# Altium project ELEC221.PrjPcb
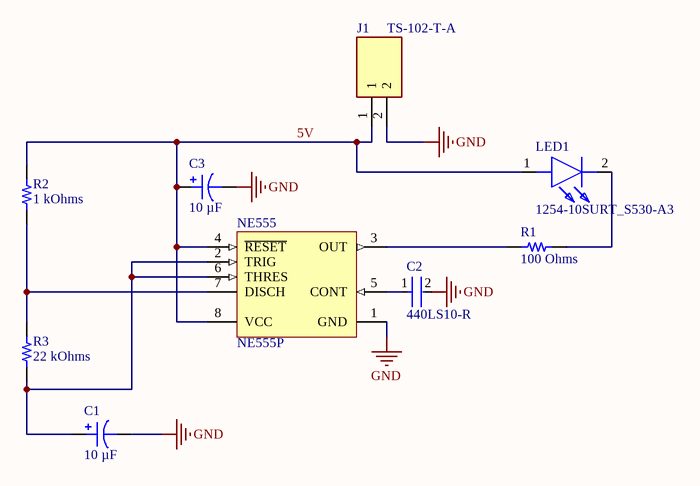
[diagram p0: TOP.SchDoc]
1 sheet, 9 parts. Net scope: global (net labels, ports and power ports of the same name join across sheets).
Board file: PCB.PcbDoc

## Sheet TOP.SchDoc
size A; SheetNumber: 1; SheetTotal: 1

### Parts
C1  10 µF  [CAP AL TH D8 L3.5 H12.5]
C2  440LS10-R  [FP-440LS10-R-MFG]
C3  10 µF  [CAP AL TH D8 L3.5 H12.5]
J1  TS-102-T-A  [SAMTEC_TS-102-T-A]
LED1  1254-10SURT_S530-A3  [125410SURTS530A3]
NE555  NE555P  [P0008A]
R1  100 Ohms  [RES 2512_6432]
R2  1 kOhms  [RES 2512_6432]
R3  22 kOhms  [RES 2512_6432]

### Nets
GND: C1.2 C2.2 C3.2 J1.2 NE555.1(GND)
5V: C3.1 J1.1 LED1.1(A) NE555.4(~{RESET}) NE555.8(VCC) R2.2
NetC1_1: C1.1 NE555.2(TRIG) NE555.6(THRES) R3.1
NetC2_1: C2.1 NE555.5(CONT)
NetLED1_2: LED1.2(K) R1.2
NetNE555_3: NE555.3(OUT) R1.1
NetNE555_7: NE555.7(DISCH) R2.1 R3.2

### Library data of the parts
C1 C3 = UKL2A100MPD1TD: CAP ALUM 10UF 20% 100V RADIAL; manufacturer: Nichicon; Lifetime @ Temp.: 2000 Hrs @ 85°C; Polarization: Polar; Ripple Current @ High Frequency: 180 mA @ 10 kHz; Ripple Current @ Low Frequency: 90 mA @ 120 Hz; Part Number: UKL2A100MPD1TD; Applications: General Purpose; Capacitance: 10 µF; componentlink1description: Datasheet; componentlink1url: http://nichicon-us.com/english/products/pdfs/e-ukl.pdf; componentlink2description: DigiKey Link; componentlink2url: https://www.digikey.com/en/products/detail/nichicon/UKL2A100MPD1TD/4317213; Device Package: Radial, Can; Height - Seated (Max): 0.492" (12.50mm); lastupdated: 10/26/2023 8:29:52 PM; Lead Spacing: 0.138" (3.50mm); Lifecycle Status: Active; Minimum Order: 1; Mounting Type: Through Hole; Operating Temperature: -40°C ~ 85°C; Package / Case: Radial, Can; packaging: TapeAndBox; partid: 7259; Part Status: Active; price: 0.18; series: UKL; Size / Dimension: 0.315" Dia (8.00mm); Supplier 1: DigiKey; Supplier Part Number 1: 493-10590-1-ND; Tolerance: ±20%; value: 10 µF; Voltage - Rated: 100 V
C2 = CMP-02417-000073-1: CAP CER 10000PF 760VAC Y5U RDL; Capacitance: 10nF; Voltage: 760V; Voltage Rating: 250V; Voltage Rating (AC): 500V; Dissipation Factor: 2%; Tolerance: 20%; Lead Length: 28.8mm; Lead Diameter: 0.81mm; Lead Free: Lead Free; Max Operating Temperature: 125°C; Dielectric: Y5U; Termination: Radial; Lead Pitch: 9.5mm; Height - Seated (Max): 0.976inch; RoHS Compliant: Yes; Min Operating Temperature: -30°C; Case/Package: Radial; Construction: RADIAL; Package Quantity: 100; Depth: 5.8mm; Series: 440L; Resistor Type: Ceramic; Height: 5.8mm; Packaging: Bulk; Radiation Hardening: No; Mount: Through Hole; Contact Plating: Tin; Number of Pins: 2; Diameter: 21.6mm
J1 = TS-102-T-A: Connector; Manufacturer_Name: SAMTEC; Manufacturer_Part_Number: TS-102-T-A; Mouser Part Number: 200-TS102TA; Mouser Price/Stock: https://www.mouser.co.uk/ProductDetail/Samtec/TS-102-T-A?qs=0lQeLiL1qyYw%2F4U%252Bgf8JTQ%3D%3D; Arrow Part Number: TS-102-T-A; Arrow Price/Stock: https://www.arrow.com/en/products/ts-102-t-a/samtec?region=nac
LED1 = 1254-10SURT_S530-A3: LED; Manufacturer_Name: Everlight; Manufacturer_Part_Number: 1254-10SURT/S530-A3; Datasheet Link: https://datasheet.datasheetarchive.com/originals/distributors/Datasheets-3/DSA-55877.pdf; Height: 5.2mm; Arrow Part Number: 1254-10SURT/S530-A3; Arrow Price/Stock: https://www.arrow.com/en/products/1254-10surts530-a3/everlight-electronics?region=nac
NE555 = CMP-2000-04954-1: Precision Timer, 4.5 to 16 V, 0 to 70 degC, 8-Pin DIP, Pb-Free, Tube; Manufacturer: TexasInstruments; Maximum High Level Output Current: -200mA; Number of Internal Timers: 1; Operating Supply Voltage: 5; Maximum Low Level Output Current: 200mA; Rad Hard: No; Packaging: Rail/Tube; Manufacturer URL: http://www.ti.com/; Package Reference: P8; Package Description: 8-Pin Double In-line Package, Body 9.59 x 6.35 mm, Pitch 2.54 mm; Package URL: http://www.ti.com/lit/ml/mpdi001b/mpdi001b.pdf; Type: Standard; Datasheet URL: http://www.ti.com/general/docs/lit/getliterature.tsp?genericPartNumber=NE555&fileType=pdf; Category: Timer; Package: 8PDIP; Datasheet Version: Rev. I, 09/2014
R1 = CR2512-JW-101ELF: RES SMD 100 OHM 5% 1W 2512; Manufacturer: Bourns Inc.; Temperature Coefficient: ±200ppm/°C; Part Number: CR2512-JW-101ELF; ComponentLink1Description: Datasheet; ComponentLink1URL: https://www.bourns.com/docs/Product-Datasheets/CR2010.pdf; ComponentLink2Description: DigiKey Link; ComponentLink2URL: http://digikey.com/product-detail/en/bourns-inc/CR2512-JW-101ELF/118-CR2512-JW-101ELFCT-ND/10673850; Composition: Thick Film; Device Package: 2512 (6432 Metric); Height - Seated (Max): 0.030" (0.75mm); LastUpdated: 9/2/2020 1:26:49 AM; Lifecycle Status: Active; Minimum Order: 1; Number of Terminations: 2; Operating Temperature: -55°C ~ 155°C; Package / Case: 2512 (6432 Metric); Packaging: TapeAndReel; Part Status: Active; Power (Watts): 1W; Price: 0.07; Resistance: 100 Ohms; Series: CR2512; Size / Dimension: 0.248" L x 0.122" W (6.30mm x 3.10mm); Supplier 1: DigiKey; Supplier Part Number 1: 118-CR2512-JW-101ELFCT-ND; Supplier Device Package: 2512; Tolerance: ±5%; Value: 100 Ohms
R2 = RMCF2512FT1K00: RES 1K OHM 1% 1W 2512; Manufacturer: Stackpole Electronics Inc; Temperature Coefficient: ±100ppm/°C; Part Number: RMCF2512FT1K00; ComponentLink1Description: Datasheet; ComponentLink1URL: https://www.seielect.com/catalog/sei-rmcf_rmcp.pdf; ComponentLink2Description: DigiKey Link; ComponentLink2URL: http://digikey.com/product-detail/en/stackpole-electronics-inc/RMCF2512FT1K00/RMCF2512FT1K00CT-ND/2419062; Composition: Thick Film; Device Package: 2512 (6432 Metric); Features: Automotive AEC-Q200; Height - Seated (Max): 0.028" (0.70mm); LastUpdated: 2/17/2022 6:29:22 PM; Lifecycle Status: Active; Minimum Order: 1; Number of Terminations: 2; Operating Temperature: -55°C ~ 155°C; Package / Case: 2512 (6432 Metric); Packaging: TapeAndReel; Part Status: Active; Power (Watts): 1W; Price: 0.04; Ratings: AEC-Q200; Resistance: 1 kOhms; Series: RMCF; Size / Dimension: 0.248" L x 0.126" W (6.30mm x 3.20mm); Supplier 1: DigiKey; Supplier Part Number 1: RMCF2512FT1K00CT-ND; Supplier Device Package: 2512; Tolerance: ±1%; Value: 1 kOhms
R3 = 352222KJT: RES SMD 22K OHM 5% 3W 2512; Manufacturer: TE Connectivity Passive Product; Temperature Coefficient: ±100ppm/°C; Part Number: 352222KJT; ComponentLink1Description: Datasheet; ComponentLink1URL: https://www.te.com/commerce/DocumentDelivery/DDEController?Action=srchrtrv&DocNm=9-1773463-7&DocType=DS&DocLang=English; ComponentLink2Description: DigiKey Link; ComponentLink2URL: http://digikey.com/product-detail/en/te-connectivity-passive-product/352222KJT/A121190CT-ND/5245247; Composition: Thick Film; Device Package: 2512 (6432 Metric); Features: Automotive AEC-Q200; Height - Seated (Max): 0.047" (1.20mm); LastUpdated: 9/2/2020 1:27:05 AM; Lifecycle Status: Active; Minimum Order: 1; Number of Terminations: 2; Operating Temperature: -55°C ~ 155°C; Package / Case: 2512 (6432 Metric); Packaging: TapeAndReel; Part Status: Active; Power (Watts): 3W; Price: 0.18; Ratings: AEC-Q200; Resistance: 22 kOhms; Series: 3522, CGS; Size / Dimension: 0.250" L x 0.126" W (6.35mm x 3.20mm); Supplier 1: DigiKey; Supplier Part Number 1: A121190CT-ND; Tolerance: ±5%; Value: 22 kOhms